# EAGLE schematic AP_KACA_Controller (EAGLE 8.4.1)
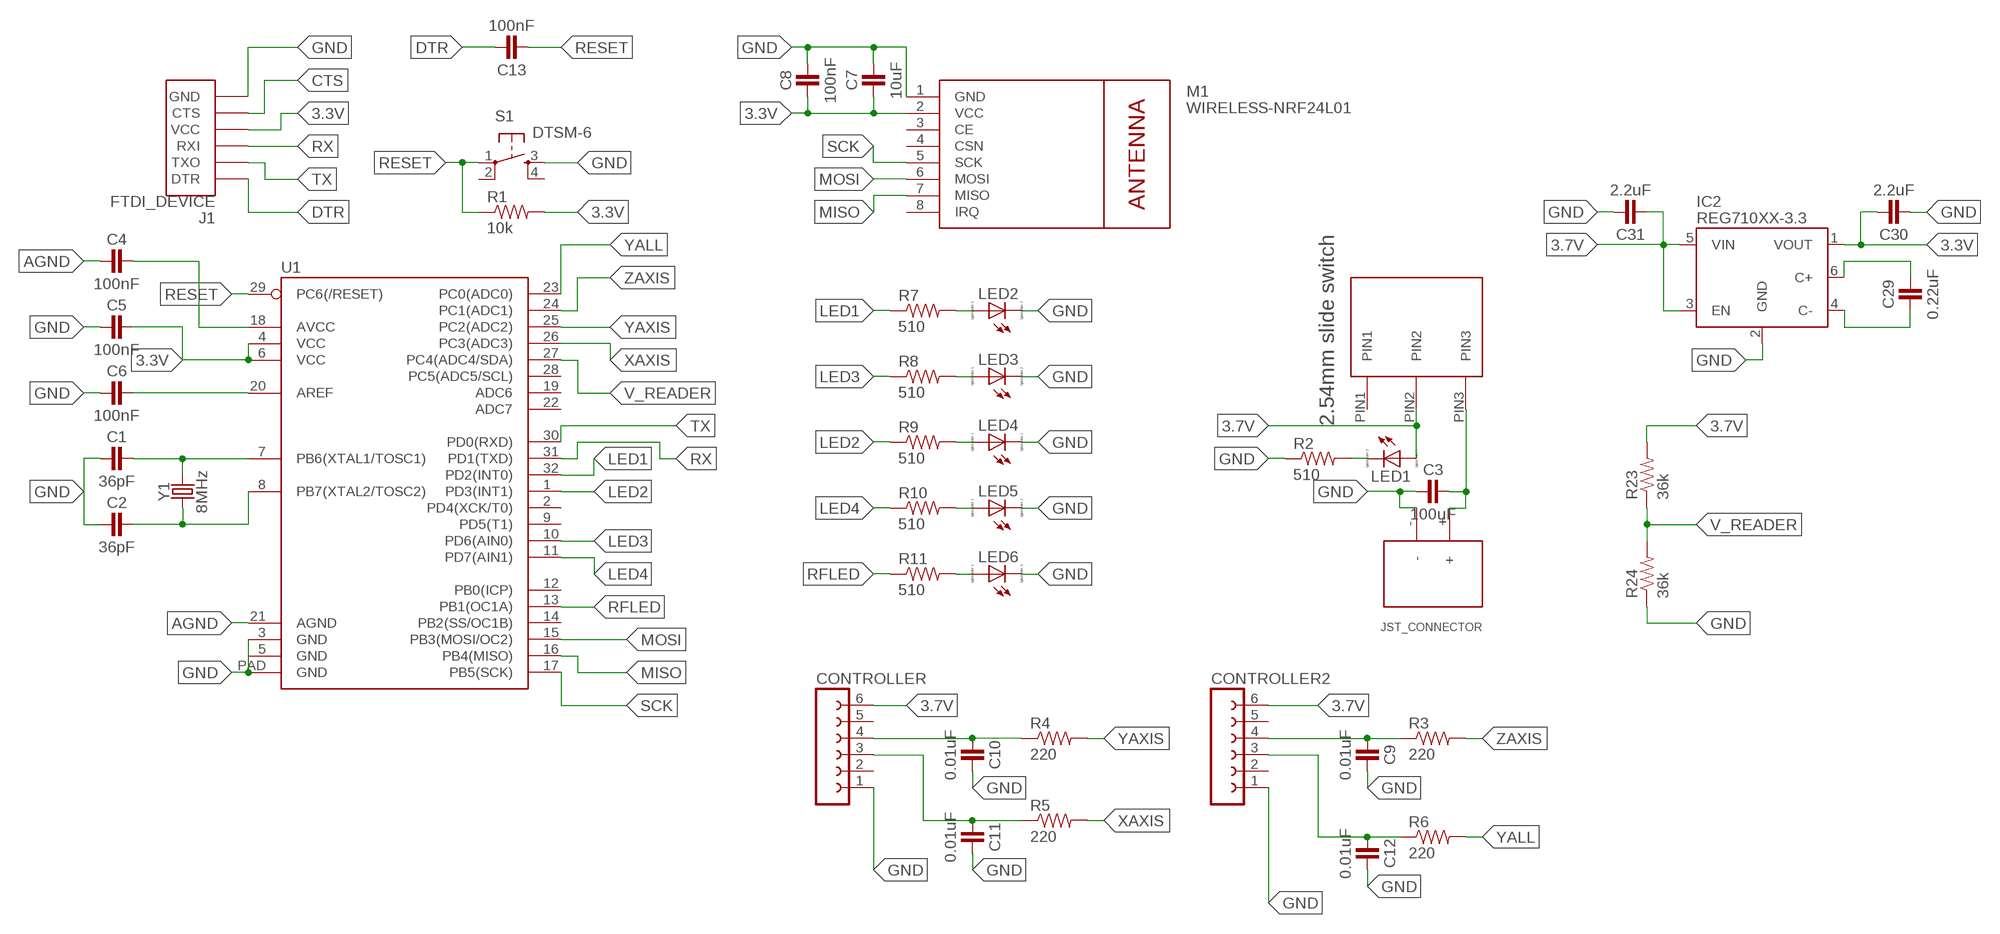
[diagram p0: schematic, sheet 1]

## Parts
C1  36pF  CAPACITOR-0603  [C0603]
C2  36pF  CAPACITOR-0603  [C0603]
C3  100uF  CAPACITOR-1206  [C1206]
C4  100nF  CAPACITOR-0603  [C0603]
C5  100nF  CAPACITOR-0603  [C0603]
C6  100nF  CAPACITOR-0603  [C0603]
C7  10uF  CAPACITOR-0603  [C0603]
C8  100nF  CAPACITOR-0603  [C0603]
C9  0.01uF  CAPACITOR-1206  [C1206]
C10  0.01uF  CAPACITOR-1206  [C1206]
C11  0.01uF  CAPACITOR-1206  [C1206]
C12  0.01uF  CAPACITOR-1206  [C1206]
C13  100nF  CAPACITOR-0603  [C0603]
C29  0.22uF  CAPACITOR-1206  [C1206]
C30  2.2uF  CAPACITOR-1206  [C1206]
C31  2.2uF  CAPACITOR-1206  [C1206]
CONTROLLER  FE06-1  [FE06]
CONTROLLER2  FE06-1  [FE06]
IC2  REG710XX-3.3  [SOT23-6]
J1  FTDI_DEVICE  [FTDI_DEVICE_SIDE]
LED1  LED_ESML0603  [LED_SML0603]
LED2  LED_ESML0603  [LED_SML0603]
LED3  LED_ESML0603  [LED_SML0603]
LED4  LED_ESML0603  [LED_SML0603]
LED5  LED_ESML0603  [LED_SML0603]
LED6  LED_ESML0603  [LED_SML0603]
M1  WIRELESS-NRF24L01  [WIRELESS-NRF24L01]
R1  10k  10.5KOHM1/10W1%(0603)  [0603]
R2  510  10.5KOHM1/10W1%(0603)  [0603]
R3  220  10.5KOHM1/10W1%(0603)  [0603]
R4  220  10.5KOHM1/10W1%(0603)  [0603]
R5  220  10.5KOHM1/10W1%(0603)  [0603]
R6  220  10.5KOHM1/10W1%(0603)  [0603]
R7  510  10.5KOHM1/10W1%(0603)  [0603]
R8  510  10.5KOHM1/10W1%(0603)  [0603]
R9  510  10.5KOHM1/10W1%(0603)  [0603]
R10  510  10.5KOHM1/10W1%(0603)  [0603]
R11  510  10.5KOHM1/10W1%(0603)  [0603]
R23  36k  10.5KOHM1/10W1%(0603)  [0603]
R24  36k  10.5KOHM1/10W1%(0603)  [0603]
S1  DTSM-6  [DTSM-6]
U1  ATMEGA328P_MLFMLF32  [MLF32-PAD]
U$1  TS02_SWITCH  [TS02_SWITCH]
U$2  JST_CONNECTOR_FEMALE  [JST_CONNECTOR_FEMALE]
Y1  8MHz  CRYSTAL-8MHZSMD-HC49UP  [HC49UP]

## Nets
3.3V: C5.2 C7.1 C8.1 C30.2 IC2.1(VOUT) J1.P$4(VCC) M1.2(VCC) R1.2 U1.4(VCC) U1.6(VCC)
3.7V: C31.1 CONTROLLER2.6 CONTROLLER.6 IC2.3(EN) IC2.5(VIN) LED1.A R23.2 U$1.PIN2
AGND: C4.1 U1.21(AGND)
CTS: J1.P$5(CTS)
DTR: C13.2 J1.P$1(DTR)
GND: C1.1 C2.1 C3.1 C5.1 C6.1 C7.2 C8.2 C9.2 C10.2 C11.2 C12.2 C30.1 C31.2 CONTROLLER2.1 CONTROLLER.1 IC2.2(GND) J1.P$6(GND) LED2.C LED3.C LED4.C LED5.C LED6.C M1.1(GND) R2.1 R24.1 S1.3 U1.3(GND) U1.PAD(GND) U$2.-
LED1: R7.1 U1.32(PD2(INT0))
LED2: R9.1 U1.1(PD3(INT1))
LED3: R8.1 U1.10(PD6(AIN0))
LED4: R10.1 U1.11(PD7(AIN1))
MISO: M1.7(MISO) U1.16(PB4(MISO))
MOSI: M1.6(MOSI) U1.15(PB3(MOSI/OC2))
N$1: C10.1 CONTROLLER.4 R4.1
N$2: C11.1 CONTROLLER.3 R5.1
N$3: C12.1 CONTROLLER2.3 R6.1
N$4: LED6.A R11.2
N$5: LED1.C R2.2
N$6: C1.2 U1.7(PB6(XTAL1/TOSC1)) Y1.2
N$7: C2.2 U1.8(PB7(XTAL2/TOSC2)) Y1.1
N$8: C3.2 U$1.PIN3 U$2.+
N$9: C6.2 U1.20(AREF)
N$11: LED2.A R7.2
N$12: C4.2 U1.18(AVCC)
N$13: LED3.A R8.2
N$18: LED4.A R9.2
N$19: LED5.A R10.2
N$32: C29.1 IC2.4(C-)
N$33: C29.2 IC2.6(C+)
RESET: C13.1 R1.1 S1.1 U1.29(PC6(/RESET))
RFLED: R11.1 U1.13(PB1(OC1A))
RX: J1.P$3(RXI) U1.31(PD1(TXD))
SCK: M1.5(SCK) U1.17(PB5(SCK))
TX: J1.P$2(TXO) U1.30(PD0(RXD))
V_READER: R23.1 R24.2 U1.27(PC4(ADC4/SDA))
XAXIS: R5.2 U1.26(PC3(ADC3))
YALL: R6.2 U1.23(PC0(ADC0))
YAXIS: R4.2 U1.25(PC2(ADC2))
ZAXIS: C9.1 CONTROLLER2.4 R3.1 R3.2 U1.24(PC1(ADC1))
Unconnected: CONTROLLER2.2 CONTROLLER2.5 CONTROLLER.2 CONTROLLER.5 M1.3(CE) M1.4(CSN) M1.8(IRQ) S1.2 S1.4 U1.2(PD4(XCK/T0)) U1.5(GND) U1.9(PD5(T1)) U1.12(PB0(ICP)) U1.14(PB2(SS/OC1B)) U1.19(ADC6) U1.22(ADC7) U1.28(PC5(ADC5/SCL)) U$1.PIN1

## Library data of the parts
C1-C13 C29-C31 = we-rcl:CAPACITOR: Capacitors ...2.2uF @ 6.3V -> 0402 ...4.7uF @ 6.3V -> 0603 ...10uF @ 16V -> 0805 ...22uF @ 25V -> 1206
CONTROLLER CONTROLLER2 = con-lsta:FE06-1: FEMALE HEADER; OC_FARNELL: unknown; OC_NEWARK: unknown
IC2 = we-power:REG710XX: TI REG710xx Charge Pump with Regulated Output TI REG710xx (60mA) 5.5V - REG71055 5.0V - REG71050 3.3V - REG710NA-3.3 3.0V - REG710NA-3 2.7V - REG710NA-2.7 2.5V - REG710NA-2.5 Diodes AP3602 (100mA) 5.0V - AP3602A 4.5V - AP3602B OnSemi CAT3200 (100mA) 5.0V - CAT3200TDI
J1 = quad:FTDI_DEVICE: Connector which mates to FTDI basic or FTDI cable.
LED1-LED6 = eagle-ltspice:LED_E: LED Source: http://www.osram.convergy.de Source: www.luxeon.com Source: www.kingbright.com; SPICEMODEL: NONE; SPICEPREFIX: D; SPICETYPE: diode
M1 = quad:WIRELESS-NRF24L01: 2.4 GHz Wireless Module based on NRF24L01 chip
R1-R11 R23 R24 = SparkFun-Resistors:10.5KOHM1/10W1%(0603): RES-09570; PROD_ID: RES-09570; VALUE: 10.5k
S1 = switch-tact:DTSM-6
U1 = SparkFun-DigitalIC:ATMEGA328P_MLF: 32-Pin Atmega328 part Commonly used on Arduino compatible boards Available in QFP and QFN packages TQFP is IC-09069 QFN is non-stock
U$1 = 2.54mm slide switch:TS02_SWITCH
U$2 = JST_CONNECTOR_FEMALE. through hole:JST_CONNECTOR_FEMALE
Y1 = SparkFun-Clocks:CRYSTAL-8MHZ: 8MHz Crystal Datasheet Example <http://www.futureelectronics.com/en/technologies/electromechanical/timing-devices/crystals/Pages/6008189-ABM3B-8.000MHZ-B2-T.aspx?IM=0> Frequency: 8MHz Frequency Tolerance: ±20ppm Load Capacitance: 18pF SparkFun Products: Pro Micro -3.3V/8MHz <https://www.sparkfun.com/products/12587> WAV Trigger <https://www.sparkfun.com/products/13660>; PROD_ID: XTAL-11706